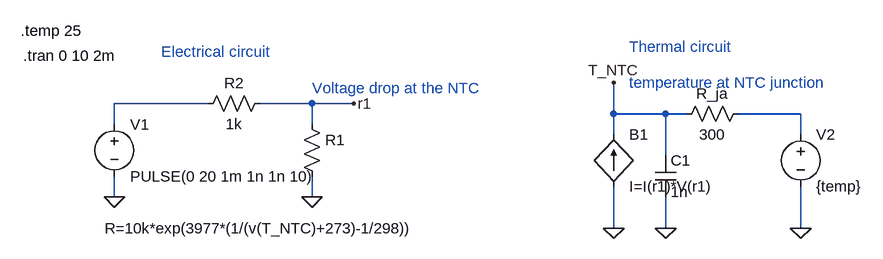
[diagram p0: schematic Draft25.asc]
Draft25.asc, the LTspice schematic file:
Version 4.1
SHEET 1 1236 680
WIRE 208 64 64 64
WIRE 368 64 288 64
WIRE 432 64 368 64
WIRE 832 80 832 32
WIRE 912 80 832 80
WIRE 944 80 912 80
WIRE 1120 80 1024 80
WIRE 64 96 64 64
WIRE 368 96 368 64
WIRE 832 112 832 80
WIRE 1120 112 1120 80
WIRE 912 144 912 80
WIRE 64 208 64 176
WIRE 368 208 368 176
WIRE 832 256 832 192
WIRE 912 256 912 208
WIRE 1120 256 1120 192
FLAG 64 208 0
FLAG 368 208 0
FLAG 432 64 r1
FLAG 832 256 0
FLAG 1120 256 0
FLAG 912 256 0
FLAG 832 32 T_NTC
SYMBOL voltage 64 80 R0
WINDOW 123 0 0 Left 0
WINDOW 39 0 0 Left 0
SYMATTR InstName V1
SYMATTR Value PULSE(0 20 1m 1n 1n 10)
SYMBOL res 192 80 R270
WINDOW 0 32 56 VTop 2
WINDOW 3 0 56 VBottom 2
SYMATTR InstName R2
SYMATTR Value 1k
SYMBOL res 352 80 R0
WINDOW 3 -303 176 Left 2
SYMATTR InstName R1
SYMATTR Value R=10k*exp(3977*(1/(v(T_NTC)+273)-1/298))
SYMBOL res 1040 64 R90
WINDOW 0 0 56 VBottom 2
WINDOW 3 32 56 VTop 2
SYMATTR InstName R_ja
SYMATTR Value 300
SYMBOL voltage 1120 96 R0
SYMATTR InstName V2
SYMATTR Value {temp}
SYMBOL cap 896 144 R0
SYMATTR InstName C1
SYMATTR Value 1n
SYMBOL bi2 832 112 R0
SYMATTR InstName B1
SYMATTR Value I=I(r1)*V(r1)
TEXT -80 -48 Left 2 !.temp 25
TEXT -76 -10 Left 2 !.tran 0 10 2m
TEXT 136 -16 Left 2 ;Electrical circuit
TEXT 856 -24 Left 2 ;Thermal circuit
TEXT 368 40 Left 2 ;Voltage drop at the NTC
TEXT 856 32 Left 2 ;temperature at NTC junction

The netlist it stands for:
* Draft25.asc
V1 N001 0 PULSE(0 20 1m 1n 1n 10)
R2 N001 r1 1k
R1 r1 0 R=10k*exp(3977*(1/(v(T_NTC)+273)-1/298))
R_ja N002 T_NTC 300
V2 N002 0 {temp}
C1 T_NTC 0 1n
B1 0 T_NTC I=I(r1)*V(r1)
.temp 25
.tran 0 10 2m
* Electrical circuit
* Thermal circuit
* Voltage drop at the NTC
* temperature at NTC junction
.backanno
.end

* Results of the author's LTspice run, read from the files saved beside the schematic
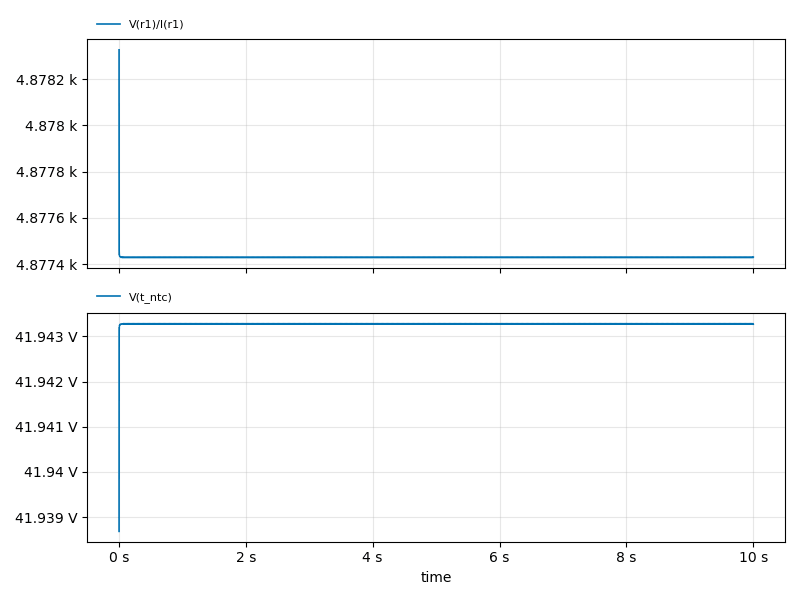
[diagram p1: Transient Analysis of Draft25.asc, plotted from the saved traces]
* Transient Analysis, 1 run:
*   V(r1)/I(r1): min 4.877 k, max 4.878 k, average 4.877 k, rms 4.877 k, last 4.877 k
*   V(t_ntc): min 41.94 V, max 41.94 V, average 41.94 V, rms 41.94 V, last 41.94 V